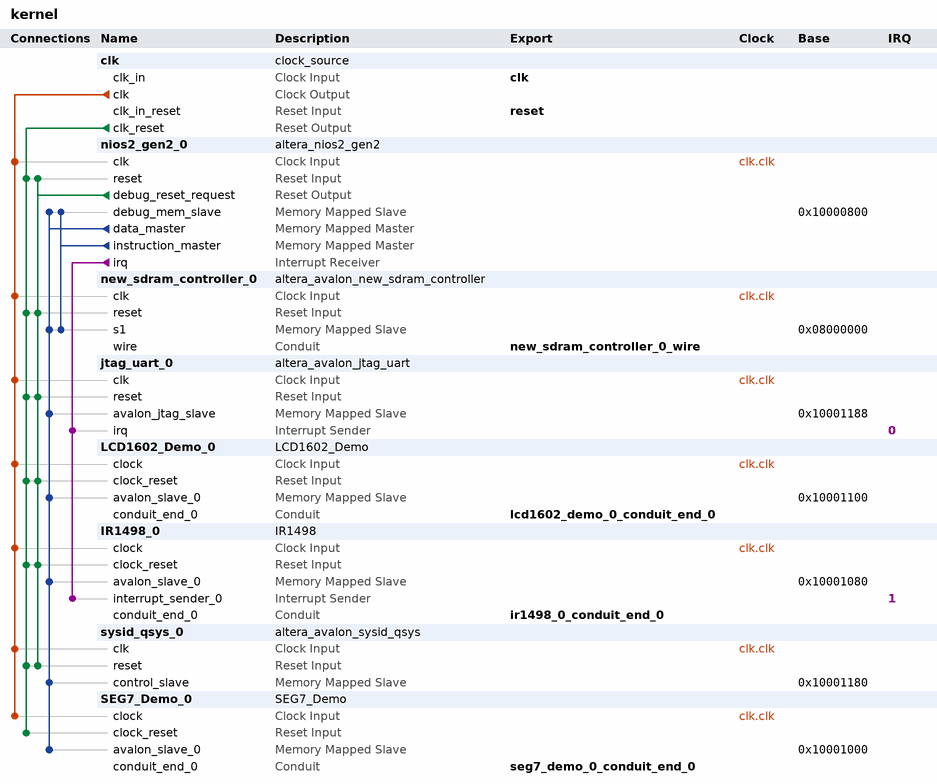
[diagram p0: system contents]
# Platform Designer (Qsys) system kernel, Cyclone IV E EP4CE115F29C7
# Parameters at their usual value, and those the tool derives, are not listed.
package require -exact qsys 15.0
create_system kernel
set_project_property DEVICE_FAMILY {Cyclone IV E}
set_project_property DEVICE EP4CE115F29C7

add_instance clk clock_source 15.0
set_instance_parameter_value clk clockFrequency 100000000

add_instance nios2_gen2_0 altera_nios2_gen2 15.0
set_instance_parameter_value nios2_gen2_0 dcache_size 0
set_instance_parameter_value nios2_gen2_0 debug_datatrigger 2
set_instance_parameter_value nios2_gen2_0 debug_hwbreakpoint 2
set_instance_parameter_value nios2_gen2_0 debug_traceType instruction_and_data_trace
set_instance_parameter_value nios2_gen2_0 exceptionSlave new_sdram_controller_0.s1
set_instance_parameter_value nios2_gen2_0 icache_size 4096
set_instance_parameter_value nios2_gen2_0 impl Fast
set_instance_parameter_value nios2_gen2_0 resetSlave new_sdram_controller_0.s1

add_instance new_sdram_controller_0 altera_avalon_new_sdram_controller 15.0
set_instance_parameter_value new_sdram_controller_0 TAC 5.5
set_instance_parameter_value new_sdram_controller_0 TRCD 20.0
set_instance_parameter_value new_sdram_controller_0 TRP 20.0
set_instance_parameter_value new_sdram_controller_0 casLatency 3
set_instance_parameter_value new_sdram_controller_0 columnWidth 10
set_instance_parameter_value new_sdram_controller_0 dataWidth 32
set_instance_parameter_value new_sdram_controller_0 generateSimulationModel false
set_instance_parameter_value new_sdram_controller_0 model single_Micron_MT48LC4M32B2_7_chip
set_instance_parameter_value new_sdram_controller_0 numberOfBanks 4
set_instance_parameter_value new_sdram_controller_0 numberOfChipSelects 1
set_instance_parameter_value new_sdram_controller_0 powerUpDelay 100.0
set_instance_parameter_value new_sdram_controller_0 refreshPeriod 15.625
set_instance_parameter_value new_sdram_controller_0 rowWidth 13

add_instance jtag_uart_0 altera_avalon_jtag_uart 15.0
set_instance_parameter_value jtag_uart_0 simInteractiveOptions NO_INTERACTIVE_WINDOWS

add_instance LCD1602_Demo_0 LCD1602_Demo 1.0

add_instance IR1498_0 IR1498 1.0

add_instance sysid_qsys_0 altera_avalon_sysid_qsys 15.0
set_instance_parameter_value sysid_qsys_0 id 1

add_instance SEG7_Demo_0 SEG7_Demo 1.0

# connections
add_connection clk.clk IR1498_0.clock clock
add_connection clk.clk jtag_uart_0.clk clock
add_connection clk.clk LCD1602_Demo_0.clock clock
add_connection clk.clk new_sdram_controller_0.clk clock
add_connection clk.clk nios2_gen2_0.clk clock
add_connection clk.clk SEG7_Demo_0.clock clock
add_connection clk.clk sysid_qsys_0.clk clock
add_connection clk.clk_reset IR1498_0.clock_reset reset
add_connection clk.clk_reset jtag_uart_0.reset reset
add_connection clk.clk_reset LCD1602_Demo_0.clock_reset reset
add_connection clk.clk_reset new_sdram_controller_0.reset reset
add_connection clk.clk_reset nios2_gen2_0.reset reset
add_connection clk.clk_reset SEG7_Demo_0.clock_reset reset
add_connection clk.clk_reset sysid_qsys_0.reset reset
add_connection nios2_gen2_0.debug_reset_request IR1498_0.clock_reset reset
add_connection nios2_gen2_0.debug_reset_request jtag_uart_0.reset reset
add_connection nios2_gen2_0.debug_reset_request LCD1602_Demo_0.clock_reset reset
add_connection nios2_gen2_0.debug_reset_request new_sdram_controller_0.reset reset
add_connection nios2_gen2_0.debug_reset_request nios2_gen2_0.reset reset
add_connection nios2_gen2_0.debug_reset_request sysid_qsys_0.reset reset
add_connection nios2_gen2_0.data_master IR1498_0.avalon_slave_0 avalon
set_connection_parameter_value nios2_gen2_0.data_master/IR1498_0.avalon_slave_0 baseAddress 0x10001080
add_connection nios2_gen2_0.data_master jtag_uart_0.avalon_jtag_slave avalon
set_connection_parameter_value nios2_gen2_0.data_master/jtag_uart_0.avalon_jtag_slave baseAddress 0x10001188
add_connection nios2_gen2_0.data_master LCD1602_Demo_0.avalon_slave_0 avalon
set_connection_parameter_value nios2_gen2_0.data_master/LCD1602_Demo_0.avalon_slave_0 baseAddress 0x10001100
add_connection nios2_gen2_0.data_master new_sdram_controller_0.s1 avalon
set_connection_parameter_value nios2_gen2_0.data_master/new_sdram_controller_0.s1 baseAddress 0x08000000
add_connection nios2_gen2_0.data_master nios2_gen2_0.debug_mem_slave avalon
set_connection_parameter_value nios2_gen2_0.data_master/nios2_gen2_0.debug_mem_slave baseAddress 0x10000800
add_connection nios2_gen2_0.data_master SEG7_Demo_0.avalon_slave_0 avalon
set_connection_parameter_value nios2_gen2_0.data_master/SEG7_Demo_0.avalon_slave_0 baseAddress 0x10001000
add_connection nios2_gen2_0.data_master sysid_qsys_0.control_slave avalon
set_connection_parameter_value nios2_gen2_0.data_master/sysid_qsys_0.control_slave baseAddress 0x10001180
add_connection nios2_gen2_0.instruction_master new_sdram_controller_0.s1 avalon
set_connection_parameter_value nios2_gen2_0.instruction_master/new_sdram_controller_0.s1 baseAddress 0x08000000
add_connection nios2_gen2_0.instruction_master nios2_gen2_0.debug_mem_slave avalon
set_connection_parameter_value nios2_gen2_0.instruction_master/nios2_gen2_0.debug_mem_slave baseAddress 0x10000800
add_connection nios2_gen2_0.irq IR1498_0.interrupt_sender_0 interrupt
set_connection_parameter_value nios2_gen2_0.irq/IR1498_0.interrupt_sender_0 irqNumber 1
add_connection nios2_gen2_0.irq jtag_uart_0.irq interrupt
set_connection_parameter_value nios2_gen2_0.irq/jtag_uart_0.irq irqNumber 0

# exported interfaces
add_interface clk clock sink
set_interface_property clk EXPORT_OF clk.clk_in
add_interface ir1498_0_conduit_end_0 conduit end
set_interface_property ir1498_0_conduit_end_0 EXPORT_OF IR1498_0.conduit_end_0
add_interface lcd1602_demo_0_conduit_end_0 conduit end
set_interface_property lcd1602_demo_0_conduit_end_0 EXPORT_OF LCD1602_Demo_0.conduit_end_0
add_interface new_sdram_controller_0_wire conduit end
set_interface_property new_sdram_controller_0_wire EXPORT_OF new_sdram_controller_0.wire
add_interface reset reset sink
set_interface_property reset EXPORT_OF clk.clk_in_reset
add_interface seg7_demo_0_conduit_end_0 conduit end
set_interface_property seg7_demo_0_conduit_end_0 EXPORT_OF SEG7_Demo_0.conduit_end_0

set_interconnect_requirement {$system} qsys_mm.clockCrossingAdapter HANDSHAKE
set_interconnect_requirement {$system} qsys_mm.enableEccProtection FALSE
set_interconnect_requirement {$system} qsys_mm.insertDefaultSlave FALSE
set_interconnect_requirement {$system} qsys_mm.maxAdditionalLatency 1

save_system kernel.qsys
